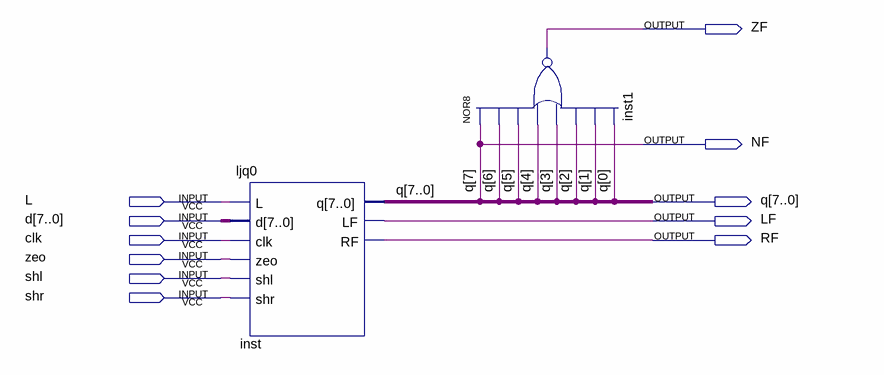
[diagram p0: schematic sheet]
// Quartus schematic ljq.bdf as structural Verilog: 2 symbols, 11 pins
module ljq (
  input  L,
  input  [7:0] d,
  input  clk,
  input  zeo,
  input  shl,
  input  shr,
  output ZF,
  output NF,
  output [7:0] q,
  output LF,
  output RF
);

  ljq0 inst (.L(L), .d(d), .clk(clk), .zeo(zeo), .shl(shl), .shr(shr), .q({NF, q[6:0]}), .LF(LF), .RF(RF));
  nor inst1 (ZF, NF, q[6], q[5], q[4], q[3], q[2], q[1], q[0]);

  assign q[7] = NF;
endmodule
